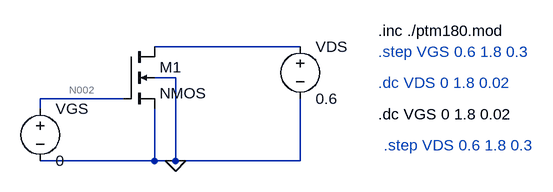
[diagram p0: schematic Draft1.asc]
Draft1.asc, the LTspice schematic file:
Version 4
SHEET 1 880 680
WIRE 288 64 64 64
WIRE 96 112 64 112
WIRE 16 144 -112 144
WIRE -112 160 -112 144
WIRE 64 240 64 160
WIRE 64 240 -112 240
WIRE 96 240 96 112
WIRE 96 240 64 240
WIRE 288 240 288 144
WIRE 288 240 96 240
FLAG 96 240 0
SYMBOL nmos4 16 64 R0
SYMATTR InstName M1
SYMATTR Value2 l=180e-9 w=180e-8
SYMBOL voltage 288 48 R0
WINDOW 123 0 0 Left 0
WINDOW 39 0 0 Left 0
SYMATTR InstName VDS
SYMATTR Value 0.6
SYMBOL voltage -112 144 R0
WINDOW 123 0 0 Left 0
WINDOW 39 0 0 Left 0
SYMATTR InstName VGS
SYMATTR Value 0
TEXT 408 40 Left 2 !.inc ./ptm180.mod
TEXT 408 72 Left 2 ;.step VGS 0.6 1.8 0.3
TEXT 408 120 Left 2 ;.dc VDS 0 1.8 0.02
TEXT 408 168 Left 2 !.dc VGS 0 1.8 0.02
TEXT 416 216 Left 2 ;.step VDS 0.6 1.8 0.3

The netlist it stands for:
* Draft1.asc
M1 N001 N002 0 0 NMOS l=180e-9 w=180e-8
VDS N001 0 0.6
VGS N002 0 0
.model NMOS NMOS
.model PMOS PMOS
.lib standard.mos
.inc ./ptm180.mod
* .step VGS 0.6 1.8 0.3
* .dc VDS 0 1.8 0.02
.dc VGS 0 1.8 0.02
* .step VDS 0.6 1.8 0.3
.backanno
.end

* Results of the author's LTspice run, read from the files saved beside the schematic
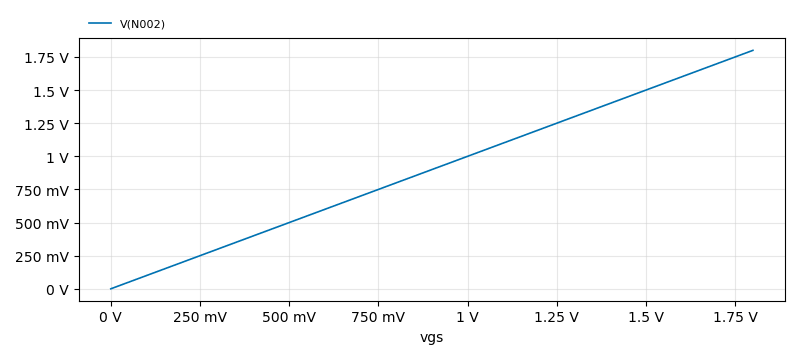
[diagram p1: DC transfer characteristic of Draft1.asc, plotted from the saved traces]
* DC transfer characteristic, 1 run:
*   V(N002): 0 V at vgs=0 V, 1.8 V at vgs=1.8 V, min 0 V, max 1.8 V